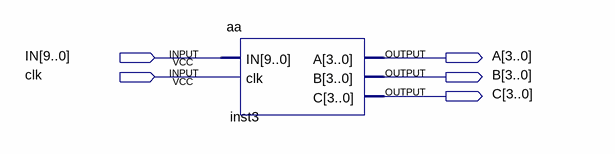
[diagram p0: schematic sheet]
// Quartus schematic EUfinal.bdf as structural Verilog: 1 symbols, 5 pins
module EUfinal (
  input  [9:0] IN,
  input  clk,
  output [3:0] A,
  output [3:0] B,
  output [3:0] C
);

  aa inst3 (.IN(IN), .clk(clk), .A(A), .B(B), .C(C));
endmodule
